# EAGLE design air (EAGLE 9.1.3)
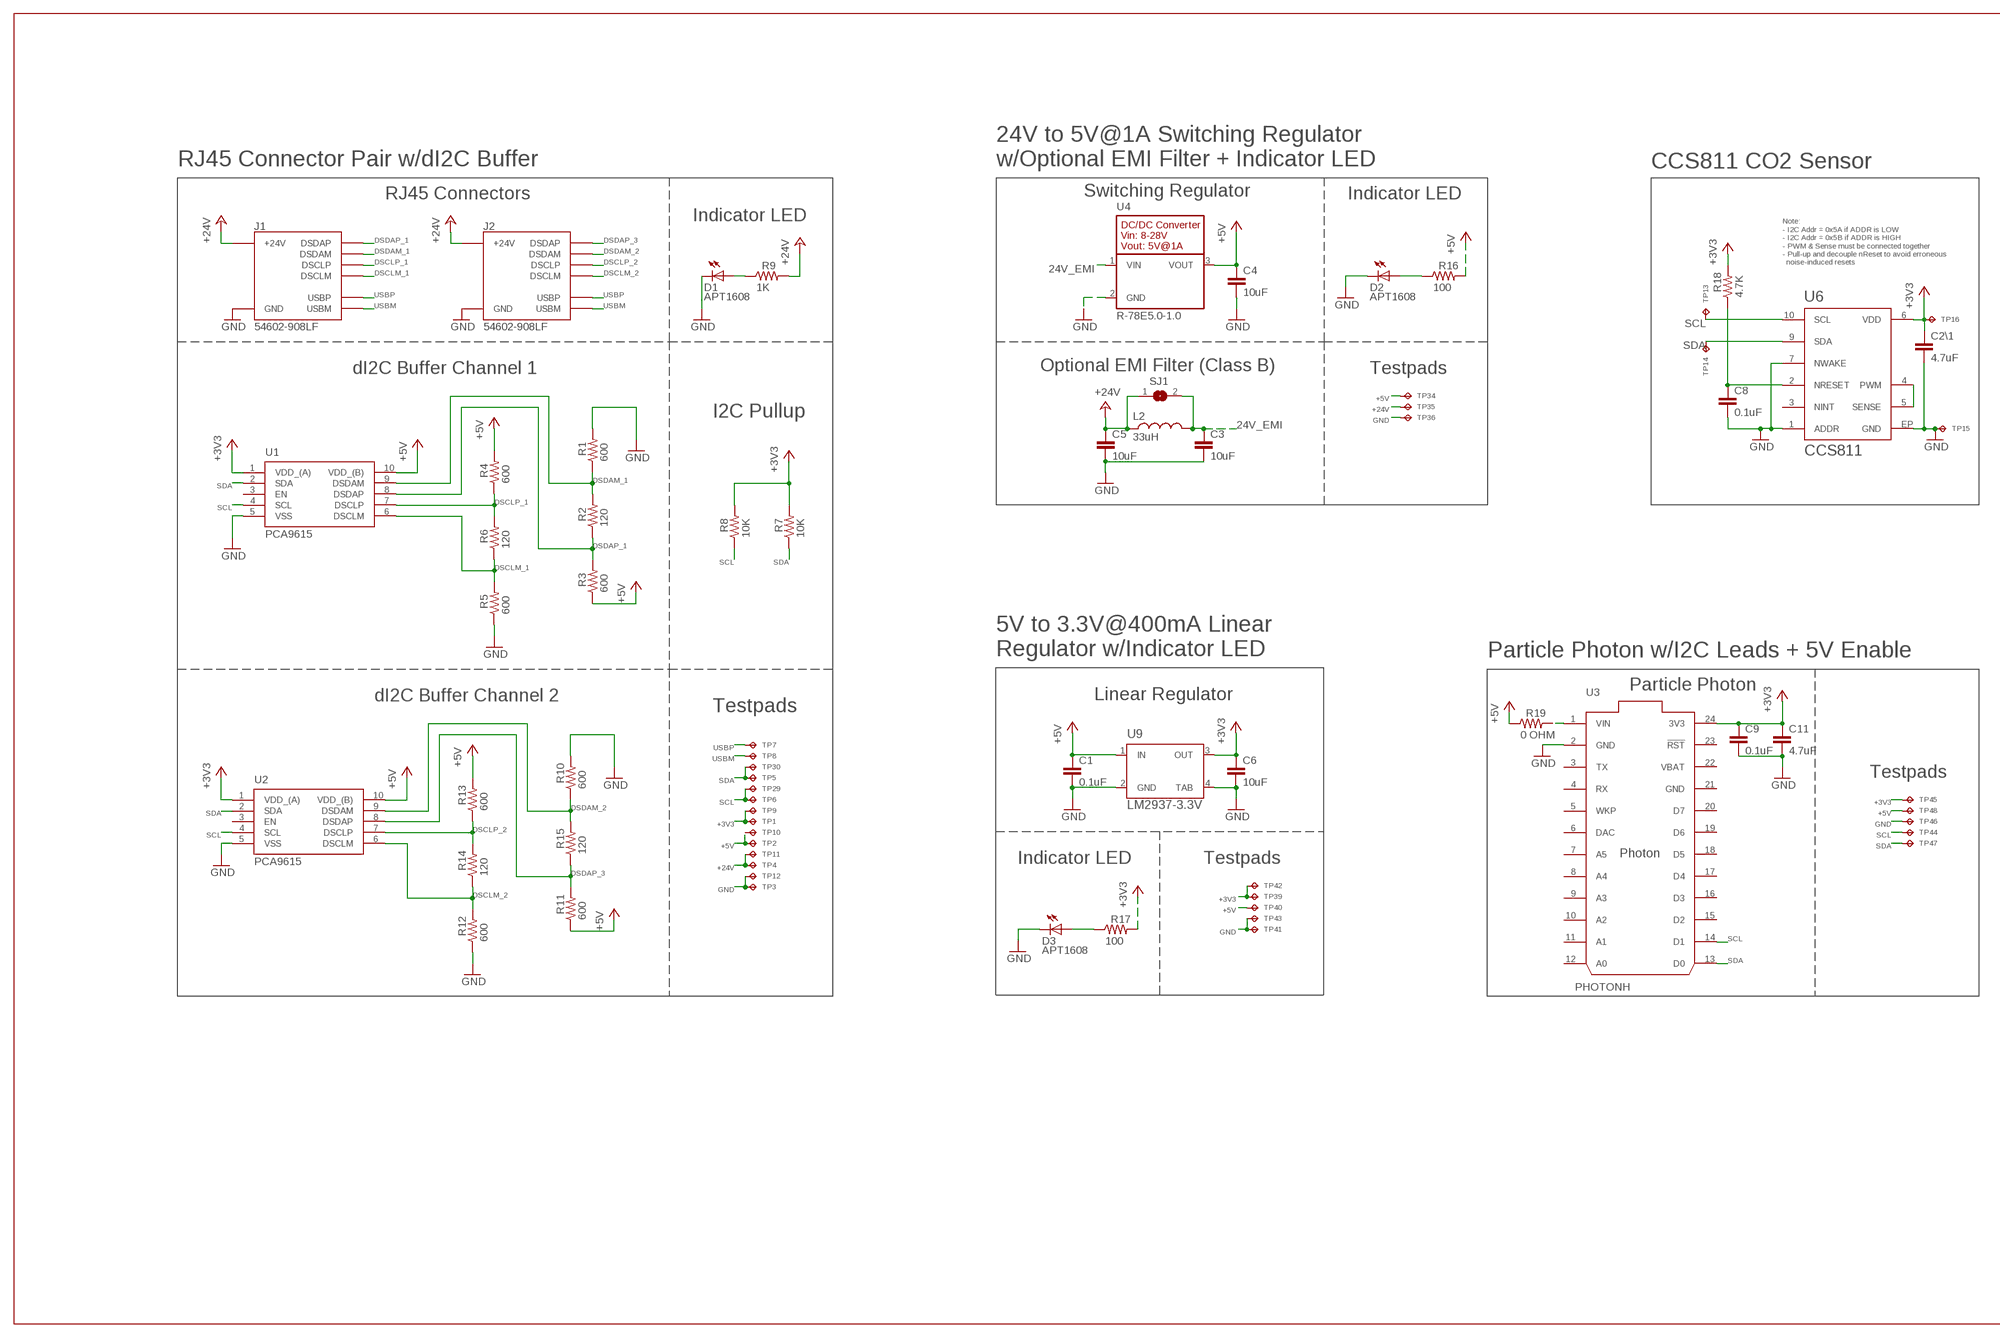
[diagram p0: schematic, sheet 1, part 1 of 2]
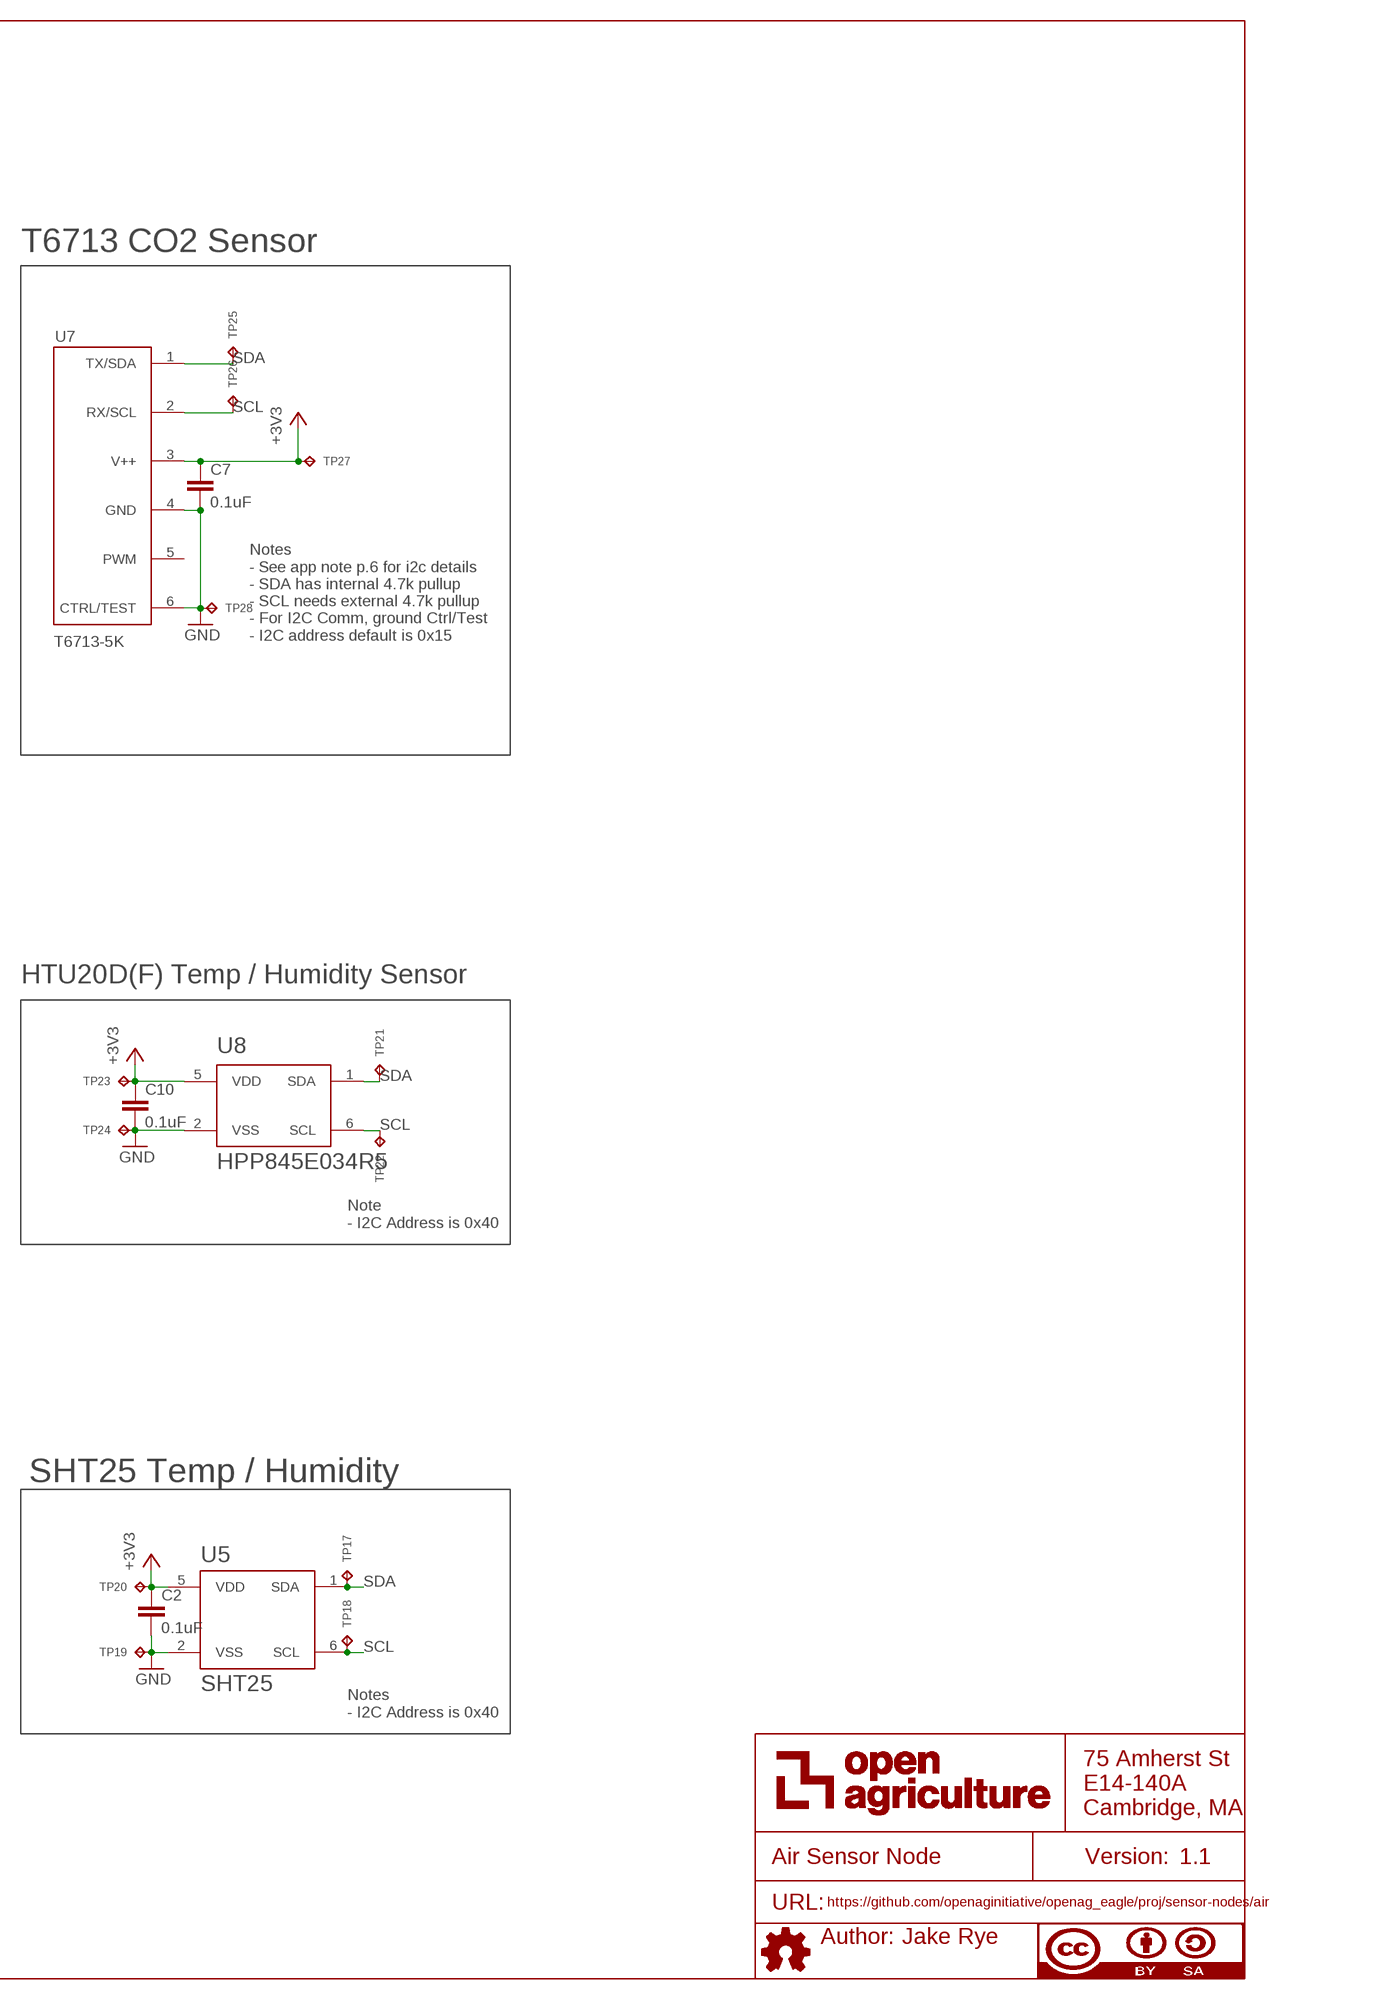
[diagram p1: schematic, sheet 1, part 2 of 2]

## Parts
C1  0.1uF  0.1UF-C0603C104K5RACTU  [C0603]
C2  0.1uF  0.1UF-C0603C104K5RACTU  [C0603]
C2\1  4.7uF  4.7UF-CL21A475KBQNNNE  [C0805]
C3  10uF  10UF-GMK212BBJ106KG-T  [C0805]
C4  10uF  10UF-GMK212BBJ106KG-T  [C0805]
C5  10uF  10UF-GMK212BBJ106KG-T  [C0805]
C6  10uF  10UF-GMK212BBJ106KG-T  [C0805]
C7  0.1uF  0.1UF-C0603C104K5RACTU  [C0603]
C8  0.1uF  0.1UF-C0603C104K5RACTU  [C0603]
C9  0.1uF  0.1UF-C0603C104K5RACTU  [C0603]
C10  0.1uF  0.1UF-C0603C104K5RACTU  [C0603]
C11  4.7uF  4.7UF-CL21A475KBQNNNE  [C0805]
D1  APT1608  APT1608CGCK  [CHIPLED_0603]
D2  APT1608  APT1608CGCK  [CHIPLED_0603]
D3  APT1608  APT1608CGCK  [CHIPLED_0603]
J1  54602-908LF  RJ45-DI2C-USB-54602-908LFPTH  [RJ45-DI2C-USB-54602-908LF]
J2  54602-908LF  RJ45-DI2C-USB-54602-908LFPTH  [RJ45-DI2C-USB-54602-908LF]
L2  33uH  33UH-29333C  [29333C]
R1  600  600OHM-RC0603FR-07604RL  [RC0603N]
R2  120  120OHM-RC0603FR-07120RL  [RC0603N]
R3  600  600OHM-RC0603FR-07604RL  [RC0603N]
R4  600  600OHM-RC0603FR-07604RL  [RC0603N]
R5  600  600OHM-RC0603FR-07604RL  [RC0603N]
R6  120  120OHM-RC0603FR-07120RL  [RC0603N]
R7  10K  10K-ERJ-3EKF1002V  [RC0603N]
R8  10K  10K-ERJ-3EKF1002V  [RC0603N]
R9  1K  1K-ERJ-PB3D1001V  [RC0603N]
R10  600  600OHM-RC0603FR-07604RL  [RC0603N]
R11  600  600OHM-RC0603FR-07604RL  [RC0603N]
R12  600  600OHM-RC0603FR-07604RL  [RC0603N]
R13  600  600OHM-RC0603FR-07604RL  [RC0603N]
R14  120  120OHM-RC0603FR-07120RL  [RC0603N]
R15  120  120OHM-RC0603FR-07120RL  [RC0603N]
R16  100  100OHM-RC0603JR-07100RL  [RC0603N]
R17  100  100OHM-RC0603JR-07100RL  [RC0603N]
R18  4.7K  4.7K-RC1206JR-074K7L  [R1206]
R19  0 OHM  0OHM-RC0603JR-070RL  [RC0603N]
SJ1  EMI-BYPASS  [EMI-BYPASS]
TP1  TPTP04R  [TP04R]
TP2  TPTP04R  [TP04R]
TP3  TPTP04R  [TP04R]
TP4  TPTP04R  [TP04R]
TP5  TPTP04R  [TP04R]
TP6  TPTP04R  [TP04R]
TP7  TPTP04R  [TP04R]
TP8  TPTP04R  [TP04R]
TP9  TPTP04R  [TP04R]
TP10  TPTP04R  [TP04R]
TP11  TPTP04R  [TP04R]
TP12  TPTP04R  [TP04R]
TP13  TPTP06R  [TP06R]
TP14  TPTP06R  [TP06R]
TP15  TPTP06R  [TP06R]
TP16  TPTP06R  [TP06R]
TP17  TPTP06R  [TP06R]
TP18  TPTP06R  [TP06R]
TP19  TPTP06R  [TP06R]
TP20  TPTP06R  [TP06R]
TP21  TPTP06R  [TP06R]
TP22  TPTP06R  [TP06R]
TP23  TPTP06R  [TP06R]
TP24  TPTP06R  [TP06R]
TP25  TPTP06R  [TP06R]
TP26  TPTP06R  [TP06R]
TP27  TPTP06R  [TP06R]
TP28  TPTP06R  [TP06R]
TP29  TPTP04R  [TP04R]
TP30  TPTP04R  [TP04R]
TP34  TPTP06R  [TP06R]
TP35  TPTP06R  [TP06R]
TP36  TPTP06R  [TP06R]
TP39  TPTP04R  [TP04R]
TP40  TPTP04R  [TP04R]
TP41  TPTP04R  [TP04R]
TP42  TPTP04R  [TP04R]
TP43  TPTP04R  [TP04R]
TP44  TPTP04R  [TP04R]
TP45  TPTP04R  [TP04R]
TP46  TPTP04R  [TP04R]
TP47  TPTP04R  [TP04R]
TP48  TPTP04R  [TP04R]
U1  PCA9615  PCA9615DPJ  [SOP50P490X110-10N]
U2  PCA9615  PCA9615DPJ  [SOP50P490X110-10N]
U3  PHOTONH  PHOTONH-LABELS  [PHOTON]
U4  R-78E5.0-1.0  [R-78E5.0-1.0]
U5  SHT25  [SHT2X]
U6  CCS811  [CCS811]
U7  T6713-5K  [T6713]
U8  HPP845E034R5  [HTU20D(F)]
U9  LM2937-3.3V  LM2937IMP-3.3/NOPB  [MP04A]
U$1  AUTHOR  [AUTHOR]
U$2  TITLE  [TITLE]

## Nets
24V_EMI: C3.1 L2.2 SJ1.2 U4.1(VIN)
+3V3: C2.1 C2\1.1 C6.1 C7.1 C9.1 C10.1 C11.1 R7.2 R8.2 R17.2 R18.2 TP1.1(TP) TP9.1(TP) TP16.TP TP20.TP TP23.TP TP27.TP TP39.1(TP) TP42.1(TP) TP45.1(TP) U1.1(VDD_(A)) U2.1(VDD_(A)) U3.24(3V3) U5.5(VDD) U6.6(VDD) U7.3(V++) U8.5(VDD) U9.3(OUT)
+5V: C1.1 C4.1 R3.1 R4.2 R11.1 R13.2 R16.2 R19.1 TP2.1(TP) TP10.1(TP) TP34.TP TP40.1(TP) TP48.1(TP) U1.10(VDD_(B)) U2.10(VDD_(B)) U4.3(VOUT) U9.1(IN)
+24V: C5.1 J1.24V(6)(+24V) J2.24V(6)(+24V) L2.1 R9.2 SJ1.1 TP4.1(TP) TP11.1(TP) TP35.TP
DSCLM_1: J1.DSCLM(5)(DSCLM) R5.2 R6.1 U1.6(DSCLM)
DSCLM_2: J2.DSCLM(5)(DSCLM) R12.2 R14.1 U2.6(DSCLM)
DSCLP_1: J1.DSCLP(4)(DSCLP) R4.1 R6.2 U1.7(DSCLP)
DSCLP_2: J2.DSCLP(4)(DSCLP) R13.1 R14.2 U2.7(DSCLP)
DSDAM_1: J1.DSDAM(2)(DSDAM) R1.1 R2.2 U1.9(DSDAM)
DSDAM_2: J2.DSDAM(2)(DSDAM) R10.1 R15.2 U2.9(DSDAM)
DSDAP_1: J1.DSDAP(1)(DSDAP) R2.1 R3.2 U1.8(DSDAP)
DSDAP_3: J2.DSDAP(1)(DSDAP) R11.2 R15.1 U2.8(DSDAP)
GND: C1.2 C2.2 C2\1.2 C3.2 C4.2 C5.2 C6.2 C7.2 C8.2 C9.2 C10.2 C11.2 D1.C D2.C D3.C J1.GND(3)(GND) J2.GND(3)(GND) R1.2 R5.1 R10.2 R12.1 TP3.1(TP) TP12.1(TP) TP15.TP TP19.TP TP24.TP TP28.TP TP36.TP TP41.1(TP) TP43.1(TP) TP46.1(TP) U1.5(VSS) U2.5(VSS) U3.2(GND) U4.2(GND) U5.2(VSS) U6.1(ADDR) U6.7(NWAKE) U6.EP(GND) U7.4(GND) U7.6(CTRL/TEST) U8.2(VSS) U9.2(GND) U9.4(TAB)
N$4: D2.A R16.1
N$5: D3.A R17.1
N$6: D1.A R9.1
N$8: R19.2 U3.1(VIN)
N$20: U6.4(PWM) U6.5(SENSE)
N$21: C8.1 R18.1 U6.2(NRESET)
SCL: R8.1 TP6.1(TP) TP13.TP TP18.TP TP22.TP TP26.TP TP29.1(TP) TP44.1(TP) U1.4(SCL) U2.4(SCL) U3.14(D1) U5.6(SCL) U6.10(SCL) U7.2(RX/SCL) U8.6(SCL)
SDA: R7.1 TP5.1(TP) TP14.TP TP17.TP TP21.TP TP25.TP TP30.1(TP) TP47.1(TP) U1.2(SDA) U2.2(SDA) U3.13(D0) U5.1(SDA) U6.9(SDA) U7.1(TX/SDA) U8.1(SDA)
USBM: J1.USBM(8)(USBM) J2.USBM(8)(USBM) TP8.1(TP)
USBP: J1.USBP(7)(USBP) J2.USBP(7)(USBP) TP7.1(TP)
Unconnected: U1.3(EN) U2.3(EN) U3.3(TX) U3.4(RX) U3.5(WKP) U3.6(DAC) U3.7(A5) U3.8(A4) U3.9(A3) U3.10(A2) U3.11(A1) U3.12(A0) U3.15(D2) U3.16(D3) U3.17(D4) U3.18(D5) U3.19(D6) U3.20(D7) U3.23(!RST) U6.3(NINT) U7.5(PWM)

## Notes on the sheet
- RJ45 Connector Pair w/dI2C Buffer
- 24V to 5V@1A Switching Regulator
  w/Optional EMI Filter + Indicator LED
- CCS811 CO2 Sensor | T6713 CO2 Sensor
- RJ45 Connectors | Switching Regulator | Indicator LED
- Indicator LED
- Note:
  - I2C Addr = 0x5A if ADDR is LOW
  - I2C Addr = 0x5B if ADDR is HIGH
  - PWM & Sense must be connected together
  - Pull-up and decouple nReset to avoid erroneous
    noise-induced resets
- dI2C Buffer Channel 1 | Optional EMI Filter (Class B) | Testpads
- I2C Pullup
- Notes
  - See app note p.6 for i2c details
  - SDA has internal 4.7k pullup
  - SCL needs external 4.7k pullup
  - For I2C Comm, ground Ctrl/Test
  - I2C address default is 0x15
- 5V to 3.3V@400mA Linear 
  Regulator w/Indicator LED
- Particle Photon w/I2C Leads + 5V Enable | HTU20D(F) Temp / Humidity Sensor
- Particle Photon
- dI2C Buffer Channel 2 | Linear Regulator
- Testpads
- Testpads
- Note
  - I2C Address is 0x40
- Indicator LED | Testpads
- SHT25 Temp / Humidity
- Notes
  - I2C Address is 0x40

## Power pins joined to a net without a drawn wire
GND: U3.21(GND)
VBAT: U3.22(VBAT)

## Library data of the parts
C1 C2 C7-C10 = openag-capacitors:0.1UF-C0603C104K5RACTU: CAP CER 0.1UF 50V X7R 0603 Description: 0.1µF ±10% 50V Ceramic Capacitor X7R 0603 (1608 Metric) Technical Specifications: Capacitance: 0.1µF Tolerance: ±10% Rated Voltage: 50V Temperature Coefficient: X7R Operating Temperature: -55°C ~ 125°C Package / Case: 0603 (1608 Metric) Datasheet(s): X7R Dielectric, 6.3-250 VDC <https://search.kemet.com/component-edge/download/datasheet/C0603C104K5RACTU.pdf> Vendor(s): Digikey: 399-5089-1-ND <https://www.digikey.com/product-detail/en/kemet/C0603C104K5RACTU/399-5089-1-ND/1465623>; MANUFACTURER: Kemet; MPN: C0603C104K5RACTU; VENDOR: Digikey; VLINK: https://www.digikey.com/product-detail/en/kemet/C0603C104K5RACTU/399-5089-1-ND/1465623; VPN: 399-5089-1-ND
C2\1 C11 = openag-capacitors:4.7UF-CL21A475KBQNNNE: CAP CER 4.7UF 50V X5R 0805 Description: 4.7µF ±10% 50V Ceramic Capacitor X5R 0805 (2012 Metric) Technical Specifications: Capacitance: 4.7uF Tolerance: ±10% Rated Voltage: 50V Temperature Coefficient: X5R Operating Temperature: -55°C ~ 85°C Package/Case: 0805 (2012 Metric) Datasheet(s): CL21A475KBQNNNE Characteristics <http://www.samsungsem.com/kr/front/downloadcms.do?path=/kr/support/product-search/mlcc/__icsFiles/afieldfile/2014/11/05&fileName=C_CL21A475KBQNNNE.pdf> Vendor(s): Digikey: 1276-1248-1-ND <https://www.digikey.com/product-detail/en/samsung-electro-mechanics/CL21A475KBQNNNE/1276-1248-1-ND/3889334>; MANUFACTURER: Samsung; MPN: CL21A475KBQNNNE; VENDOR: Digikey; VLINK: https://www.digikey.com/product-detail/en/samsung-electro-mechanics/CL21A475KBQNNNE/1276-1248-1-ND/3889334; VPN: 1276-1248-1-ND
C3-C6 = openag-capacitors:10UF-GMK212BBJ106KG-T: CAP CER 10UF 35V X5R 0805 Description: 10µF ±10% 35V Ceramic Capacitor X5R 0805 (2012 Metric) Technical Specifications: Capacitance: 10µF Tolerance: ±10% Rated Voltage: 35V Temperature Coefficient: X5R Operating Temperature: -55°C ~ 85°C Package / Case: 0805 (2012 Metric) Datasheet(s): GMK212BBJ106KG-T Spec <http://ds.yuden.co.jp/TYCOMPAS/ut/detail.do?productNo=GMK212BBJ106KG-T&fileName=GMK212BBJ106KG-T_SS&mode=specSheetDownload> Vendor(s): Digikey: 587-4893-1-ND <https://www.digikey.com/product-detail/en/taiyo-yuden/GMK212BBJ106KG-T/587-4893-1-ND/6563736>; MANUFACTURER: Taiyo Yuden; MPN: GMK212BBJ106KG-T; VENDOR: Digikey; VLINK: https://www.digikey.com/product-detail/en/taiyo-yuden/GMK212BBJ106KG-T/587-4893-1-ND/6563736; VPN: 587-4893-1-ND
D1-D3 = openag-diodes:APT1608CGCK: LED GREEN CLEAR 0603 SMD Description: Green 570nm LED Indication - Discrete 2.1V 0603 (1608 Metric) Technical Specifications: Color: Green Lens Color: Colorless Lens Transparency: Clear Millicandela Rating: 50mcd Lens Style/Size: Rectangle with Flat Top, 1.20mm x 0.80mm Voltage - Forward (Vf) (Typ): 2.1V Current - Test: 20mA Viewing Angle: 120° Mounting Type: Surface Mount Wavelength - Dominant: 570nm Wavelength - Peak: 574nm Package / Case: 0603 (1608 Metric) Supplier Device Package: Chip LED Size / Dimension: 1.60mm L x 0.80mm W Height (Max): 0.75mm Datasheet(s): APT1608CGCK <http://www.kingbrightusa.com/images/catalog/SPEC/APT1608CGCK.pdf> Vendor(s): Digikey: 754-1116-1-ND <https://www.digikey.com/product-detail/en/kingbright/APT1608CGCK/754-1116-1-ND/1747833#>; MANUFACTURER: Kingbright; MPN: APT1608CGCK; VENDOR: Digikey; VLINK: https://www.digikey.com/product-detail/en/kingbright/APT1608CGCK/754-1116-1-ND/1747833#; VPN: 754-1116-1-ND
J1 J2 = openag-connectors:RJ45-DI2C-USB-54602-908LF: CONN MOD JACK 8P8C R/A UNSHLD Description: Jack Modular Connector 8p8c (RJ45, Ethernet) 90° Angle (Right) Unshielded Cat3 Technical Specifications: Connector Type: Jack Number of Positions/Contacts: 8p8c (RJ45, Ethernet) Number of Ports: 1 Number of Rows: 1 Mounting Type: Through Hole Orientation: 90° Angle (Right) Termination: Solder Shielding: Unshielded Ratings: Cat3 Features: Board Lock LED Color: Does Not Contain LED Tab Direction: Down Contact Material: Copper Alloy Contact Finish: Gold Contact Finish Thickness: 15µin (0.38µm) Housing Material: Polyester, Glass Filled Operating Temperature: -40°C ~ 70°C Datasheet(s): 54601-x04(zzz)WPLF Drawing <http://cdn.amphenol-icc.com/media/wysiwyg/files/drawing/c-bmj-0102.pdf> Vendor(s): Digikey: 609-1046-ND <https://www.digikey.com/product-detail/en/amphenol-fci/54602-908LF/609-1046-ND/1001360>; MANUFACTURER: Amphenol FCI; MPN: 54602-908LF; VENDOR: Digikey; VLINK: https://www.digikey.com/product-detail/en/amphenol-fci/54602-908LF/609-1046-ND/1001360; VPN: 609-1046-ND
L2 = openag-inductors:33UH-29333C: FIXED IND 33UH 1A 120 MOHM SMD Description: 33µH Shielded Wirewound Inductor 1A 120 mOhm Max Nonstandard Technical Specifications: Type: Wirewound Inductance: 33µH Current Rating: 1A Shielding: Shielded DC Resistance (DCR): 120 mOhm Max Operating Temperature: -40°C ~ 85°C Frequency - Test: 10kHz Mounting Type: Surface Mount Package / Case: Nonstandard Size / Dimension: 0.283" L x 0.283" W (7.20mm x 7.20mm) Height - Seated (Max): 0.157" (4.00mm) Datasheet(s): 2900 Series <https://www.murata-ps.com/data/magnetics/kmp_2900.pdf> Vendor(s): Digikey: 811-1138-1-ND <https://www.digikey.com/product-detail/en/murata-power-solutions-inc/29333C/811-1138-1-ND/1924860>; MANUFACTURER: Murata Power Solutions Inc.; MPN: 29333C; VENDOR: Digikey; VLINK: https://www.digikey.com/product-detail/en/murata-power-solutions-inc/29333C/811-1138-1-ND/1924860; VPN: 811-1138-1-ND
R1 R3-R5 R10-R13 = openag-resistors:600OHM-RC0603FR-07604RL: RES SMD 604 OHM 1% 1/10W 0603 Description: 604 Ohms ±1% 0.1W, 1/10W Chip Resistor 0603 (1608 Metric) Moisture Resistant Thick Film Technical Specifications: Resistance: 604 Ohms Tolerance: ±1% Power (Watts): 0.1W, 1/10W Composition: Thick Film Features: Moisture Resistant Temperature Coefficient: ±100ppm/°C Operating Temperature: -55°C ~ 155°C Package / Case: 0603 (1608 Metric) Supplier Device Package: 0603 Size / Dimension: 0.063" L x 0.032" W (1.60mm x 0.80mm) Height - Seated (Max): 0.022" (0.55mm) Number of Terminations: 2 Datasheet(s): RC Series, L Datasheet <http://www.yageo.com/documents/recent/PYu-RC_Group_51_RoHS_L_8.pdf> Chip Resistor Marking <http://www.yageo.com/exep/pages/download/literatures/PYu-R_Marking_2.pdf> Vendor(s): Digikey: 311-604HRCT-ND <https://www.digikey.com/product-detail/en/yageo/RC0603FR-07604RL/311-604HRCT-ND/730276>; MANUFACTURER: Yageo; MPN: RC0603FR-07604RL; VENDOR: Digikey; VLINK: https://www.digikey.com/product-detail/en/yageo/RC0603FR-07604RL/311-604HRCT-ND/730276; VPN: 311-604HRCT-ND
R2 R6 R14 R15 = openag-resistors:120OHM-RC0603FR-07120RL: RES SMD 120 OHM 1% 1/10W 0603 Description: 120 Ohms ±1% 0.1W, 1/10W Chip Resistor 0603 (1608 Metric) Moisture Resistant Thick Film Technical Specifications: Resistance: 120 Ohms Tolerance: ±1% Power (Watts): 0.1W, 1/10W Composition: Thick Film Features: Moisture Resistant Temperature Coefficient: ±100ppm/°C Operating Temperature: -55°C ~ 155°C Package / Case: 0603 (1608 Metric) Supplier Device Package: 0603 Size / Dimension: 0.063" L x 0.032" W (1.60mm x 0.80mm) Height - Seated (Max): 0.022" (0.55mm) Number of Terminations: 2 Datasheet(s): RC Series, L Datasheet <http://www.yageo.com/documents/recent/PYu-RC_Group_51_RoHS_L_8.pdf> Chip Resistor Marking <http://www.yageo.com/exep/pages/download/literatures/PYu-R_Marking_2.pdf> Vendor(s): Digikey: 311-120HRCT-ND <https://www.digikey.com/product-detail/en/yageo/RC0603FR-07120RL/311-120HRCT-ND/729867>; MANUFACTURER: Yageo; MPN: RC0603FR-07120RL; VENDOR: Digikey; VLINK: https://www.digikey.com/product-detail/en/yageo/RC0603FR-07120RL/311-120HRCT-ND/729867; VPN: 311-120HRCT-ND
R7 R8 = openag-resistors:10K-ERJ-3EKF1002V: RES SMD 10K OHM 1% 1/10W 0603 Description: 10 kOhms ±1% 0.1W, 1/10W Chip Resistor 0603 (1608 Metric) Automotive AEC-Q200 Thick Film Technical Specifications: Resistance: 10kOhms Tolerance: ±1% Power: 0.1W, 1/10W Operating Temperature: -55°C ~ 155°C Package/Case: 0603 (1608 Metric) Datasheet(s): ERJ-3EKF1002V View All Specifications <https://industrial.panasonic.com/ww/products/resistors/chip-resistors/general-purpose-chip-resistors/precision-thick-film-chip-resistors/ERJ3EKF1002V> Vendor(s): Digikey: P10.0KHCT-ND <https://www.digikey.com/product-detail/en/panasonic-electronic-components/ERJ-3EKF1002V/P10.0KHCT-ND/198102>; MANUFACTURER: Panasonic; MPN: ERJ-3EKF1002V; VENDOR: Digikey; VLINK: https://www.digikey.com/product-detail/en/panasonic-electronic-components/ERJ-3EKF1002V/P10.0KHCT-ND/198102; VPN: P10.0KHCT-ND
R9 = openag-resistors:1K-ERJ-PB3D1001V: RES SMD 1K OHM 0.5% 1/5W 0603 Description: 1 kOhms ±0.5% 0.2W, 1/5W Chip Resistor 0603 (1608 Metric) Automotive AEC-Q200, Pulse Withstanding Thick Film Technical Specifications: Resistance: 1 kOhms Tolerance: ±0.5% Power: 0.2W, 1/5W Operating Temperature: -55°C ~ 155°C Package / Case: 0603 (1608 Metric) Datasheet(s): ERJ-PB3, PB6 Series, High Precision Datasheet <https://industrial.panasonic.com/cdbs/www-data/pdf/RDM0000/AOA0000C328.pdf> Vendor(s): Digikey: P20283CT-ND <https://www.digikey.com/product-detail/en/panasonic-electronic-components/ERJ-PB3D1001V/P20283CT-ND/6214538>; MANUFACTURER: Panasonic; MPN: P20283CT-ND; VENDOR: Digikey; VLINK: https://www.digikey.com/product-detail/en/panasonic-electronic-components/ERJ-PB3D1001V/P20283CT-ND/6214538; VPN: P20283CT-ND
R16 R17 = openag-resistors:100OHM-RC0603JR-07100RL: RES SMD 100 OHM 5% 1/10W 0603 Description: 100 Ohms ±5% 0.1W, 1/10W Chip Resistor 0603 (1608 Metric) Moisture Resistant Thick Film Technical Specifications: Resistance: 100 Ohms Tolerance: ±5% Power (Watts): 0.1W, 1/10W Composition: Thick Film Features: Moisture Resistant Temperature Coefficient: ±100ppm/°C Operating Temperature: -55°C ~ 155°C Package / Case: 0603 (1608 Metric) Supplier Device Package: 0603 Size / Dimension: 0.063" L x 0.032" W (1.60mm x 0.80mm) Height - Seated (Max): 0.022" (0.55mm) Number of Terminations: 2 Datasheet(s): Thick Film Chip Resistor Intro <http://www.yageo.com.tw/exep/pages/download/literatures/PYu-R_INT-thick_7.pdf> Chip Resistor Marking <http://www.yageo.com/exep/pages/download/literatures/PYu-R_Marking_2.pdf> RC Series, L Datasheet <http://www.yageo.com/documents/recent/PYu-RC_Group_51_RoHS_L_8.pdf> Vendor(s): Digikey: 311-100GRCT-ND <https://www.digikey.com/product-detail/en/yageo/RC0603JR-07100RL/311-100GRCT-ND/729644>; MANUFACTURER: Yageo; MPN: RC0603JR-07100RL; VENDOR: Digikey; VLINK: https://www.digikey.com/product-detail/en/yageo/RC0603JR-07100RL/311-100GRCT-ND/729644; VPN: 311-100GRCT-ND
R18 = openag-resistors:4.7K-RC1206JR-074K7L: RES SMD 4.7K OHM 5% 1/4W 1206 Description: 4.7 kOhms ±5% 0.25W, 1/4W Chip Resistor 1206 (3216 Metric) Moisture Resistant Thick Film Technical Specifications: Resistance: 4.7 kOhms Tolerance: ±5% Power (Watts): 0.25W, 1/4W Composition: Thick Film Features: Moisture Resistant Temperature Coefficient: ±100ppm/°C Operating Temperature: -55°C ~ 155°C Package / Case: 1206 (3216 Metric) Supplier Device Package: 1206 Size / Dimension: 0.122" L x 0.063" W (3.10mm x 1.60mm) Height - Seated (Max): 0.026" (0.65mm) Number of Terminations: 2 Datasheet(s): Thick Film Chip Resistor Intro <http://www.yageo.com.tw/exep/pages/download/literatures/PYu-R_INT-thick_7.pdf> Chip Resistor Marking <http://www.yageo.com/exep/pages/download/literatures/PYu-R_Marking_2.pdf> RC Series, L Datasheet <http://www.yageo.com/documents/recent/PYu-RC_Group_51_RoHS_L_8.pdf> Vendor(s): Digikey: 311-4.7KERCT-ND <https://www.digikey.com/product-detail/en/yageo/RC1206JR-074K7L/311-4.7KERCT-ND/732242>; MANUFACTURER: Yageo; MPN: RC1206JR-074K7L; VENDOR: Digikey; VLINK: https://www.digikey.com/product-detail/en/yageo/RC1206JR-074K7L/311-4.7KERCT-ND/732242; VPN: 311-4.7KERCT-ND
R19 = openag-resistors:0OHM-RC0603JR-070RL: RES SMD 0 OHM JUMPER 1/10W 0603 Description: 0 Ohms Jumper 0.1W, 1/10W Chip Resistor 0603 (1608 Metric) Moisture Resistant Thick Film Technical Specifications: Resistance: 0 Ohms Power: 0.1W, 1/10W Operating Temperature: -55°C ~ 155°C Package / Case: 0603 (1608 Metric) Datasheet(s): RC Series, L Datasheet <http://www.yageo.com/documents/recent/PYu-RC_Group_51_RoHS_L_8.pdf> Vendor(s): Digikey: 311-0.0GRCT-ND <https://www.digikey.com/product-detail/en/yageo/RC0603JR-070RL/311-0.0GRCT-ND/729622>; MANUFACTURER: Yageo; MPN: RC0603JR-070RL; VENDOR: Digikey; VLINK: https://www.digikey.com/product-detail/en/yageo/RC0603JR-070RL/311-0.0GRCT-ND/729622; VPN: 311-0.0GRCT-ND
SJ1 = openag-connectors:EMI-BYPASS: EMI Bypass Solder Jumper; MPN: N/A
TP1-TP30 TP34-TP36 TP39-TP48 = openag-testpads:TP: Test pad; MPN: N/A
U1 U2 = openag-redrivers:PCA9615DPJ: IC REDRIVER I2C 2CH 10TSSOP Description: Buffer, ReDriver 2 Channel 400kHz 10-TSSOP Technical Specifications: Type: Buffer, ReDriver Applications: I²C Input: 2-Wire Bus Output: 2-Wire Bus Data Rate (Max): 400kHz Number of Channels: 2 Capacitance - Input: 7pF Voltage - Supply: 2.3 V ~ 5.5 V Current - Supply: 16µA Operating Temperature: -40°C ~ 85°C Package / Case: 10-TFSOP, 10-MSOP (0.118", 3.00mm Width) Supplier Device Package: 10-TSSOP Base Part Number: PCA9615 Datasheet(s): PCA9615DP <http://www.nxp.com/documents/data_sheet/PCA9615.pdf> Vendor(s): Digikey: 568-11484-1-ND <https://www.digikey.com/product-detail/en/nxp-usa-inc/PCA9615DPJ/568-11484-1-ND/4864508>; MANUFACTURER: NXP USA Inc.; MPN: PCA9615DPJ; VENDOR: Digikey; VLINK: https://www.digikey.com/product-detail/en/nxp-usa-inc/PCA9615DPJ/568-11484-1-ND/4864508; VPN: 568-11484-1-ND
U3 = openag-microcontrollers:PHOTONH: Tiny Wi-Fi dev board w/cloud backend Description: The Photon is a $19 tiny Wi-Fi development kit for creating connected projects and products for the Internet of Things. It's easy to use, it's powerful, and it's connected to the cloud. Technical Specifications: Processor: STM32F205RGY6 120Mhz ARM Cortex M3 Wireless: 802.11b/g/n Wi-Fi Peripherals: Digital(x18), ADC(x8), DAC(x2), SPI(x2), I2S(x1), I2C(x1) SPI, CAN(1), USB(1), PWM(9) Memory: 1MB flash, 128KB RAM Cerfifications: FCC, CE and IC Operating Temperature: -20°C ~ 60°C Humidity Range: Non condensing, relative humidity: 95% Supply Input Voltage (VIN): 3.6V ~ 5.5V Supply Input Voltage (3V3): 3.0V ~ 3.6V Max Supply Output Current (VIN): 1A Max Supply Output Current (3V3): 100mA Average Operating Current (WiFi on, @VIN): up to 100mA Peak Operating Current (WiFi on, @VIN): up to 430mA I/O Max Source/Sink Current (Individual): 25mA I/O Max Source/Sinnk Current (Total): 120mA Datasheet(s): Photon Datasheet <https://docs.particle.io/datasheets/photon-datasheet/> Vendor(s): Particle: PHOTONH <https://store.particle.io/products/photon>; MANUFACTURER: Particle; MPN: PHOTONH; VENDOR: Particle; VLINK: https://store.particle.io/products/photon; VPN: PHOTONH
U4 = openag-regulators:R-78E5.0-1.0: DC/DC CONVERTER 5V 5W Description: Linear Regulator Replacement DC DC Converter 1 Output 5V 1A 8V - 28V Input Technical Specifications: Type: Linear Regulator Replacement Number of Outputs: 1 Voltage - Input (Min): 8V Voltage - Input (Max): 28V Voltage - Output 1: 5V Current - Output (Max): 1A Power (Watts): 5W Applications: ITE (Commercial) Features: SCP Operating Temperature: -40°C ~ 85°C Efficiency: 91% Mounting Type: Through Hole Package / Case: 3-SIP Module Size / Dimension: 0.46" L x 0.33" W x 0.41" H (11.6mm x 8.5mm x 10.4mm) Datasheet(s): R-78E-1.0 Series Datasheet <https://www.recom-power.com/pdf/Innoline/R-78Exx-1.0.pdf> Vendor(s): Digikey: 945-2201-ND <https://www.digikey.com/product-detail/en/recom-power/R-78E5.0-1.0/945-2201-ND/4930585>; MANUFACTURER: Recom Power; MPN: R-78E5.0-1.0; VENDOR: Digikey; VLINK: https://www.digikey.com/product-detail/en/recom-power/R-78E5.0-1.0/945-2201-ND/4930585; VPN: 945-2201-ND
U5 = openag-sensors:SHT25: SENSOR HUMI/TEMP 3V I2C 1.8% SMD Description: Humidity Temperature Sensor 0 ~ 100% RH I²C ±1.8% RH 8s Surface Mount Technical Specifications: Sensor Type: Humidity, Temperature Humidity Range: 0 ~ 100% RH Output Type: I²C Output: 12b Accuracy: ±1.8% RH Response Time: 8s Voltage - Supply: 2.1 V ~ 3.6 V Mounting Type: Surface Mount Operating Temperature: -40°C ~ 125°C Datasheet(s): SHTxx Testing Guide <https://www.sensirion.com/fileadmin/user_upload/customers/sensirion/Dokumente/2_Humidity_Sensors/Sensirion_Humidity_Sensors_Testing_Guide_V1.2.pdf> SHTxx Handling Instructions <https://www.sensirion.com/fileadmin/user_upload/customers/sensirion/Dokumente/2_Humidity_Sensors/Sensirion_Humidity_Sensors_Handling_Instructions_V4.pdf> Sensor Specification Statement <https://www.sensirion.com/fileadmin/user_upload/customers/sensirion/Dokumente/2_Humidity_Sensors/Sensirion_Humidity_Sensors_Specification_Statement_V1.pdf> SHTxx, STSxx Assembly SMD Pkgs <https://www.sensirion.com/fileadmin/user_upload/customers/sensirion/Dokumente/2_Humidity_Sensors/Sensirion_Humidity_Sensors_Handling_of_SMD_Packages_V1.pdf> SHT25 Datasheet <https://www.sensirion.com/fileadmin/user_upload/customers/sensirion/Dokumente/2_Humidity_Sensors/Sensirion_Humidity_Sensors_SHT25_Datasheet_V3.pdf> Vendor(s): Digikey: 1649-1008-1-ND <https://www.digikey.com/product-detail/en/sensirion-ag/SHT25/1649-1008-1-ND/5872290>; MANUFACTURER: Sensirion AG; MPN: SHT25; VENDOR: Digikey; VLINK: https://www.digikey.com/product-detail/en/sensirion-ag/SHT25/1649-1008-1-ND/5872290; VPN: 1649-1008-1-ND
U6 = openag-sensors:CCS811: LOW POWER DIGITAL SENSOR FOR IND Description: Air Quality Sensor I²C Technical Specifications: Type: Air Quality Output: I²C Operating Temperature: -5°C ~ 50°C Voltage - Supply: 1.8 V ~ 3.6 V Current - Supply: 26mA Datasheet(s): CCS811 Datasheet <http://ams.com/eng/content/download/951091/2269479/471718> CCS811 Factsheet <http://ams.com/eng/content/view/download/490399> Vendor(s): Digikey: CCS811CT-ND <https://www.digikey.com/product-detail/en/ams/CCS811/CCS811CT-ND/6569300>; MANUFACTURER: ams; MPN: CCS811; VENDOR: Digikey; VLINK: https://www.digikey.com/product-detail/en/ams/CCS811/CCS811CT-ND/6569300; VPN: CCS811CT-ND
U7 = openag-sensors:T6713-5K: CO2 MODULE 5000PPM DIFFUSION Description: CO2 Sensor I²C Technical Specifications: Type: CO2 Accuracy: ±2% Output: I²C Operating Temperature: 14 ~ 140°F (-10 ~ 60°C) Voltage - Supply: 4.5 V ~ 5.5 V Current - Supply: 200mA Datasheet(s): T6713 Series Datasheet <http://www.amphenol-sensors.com/en/component/edocman/297-telaire-t6713-series-datasheet/download?Itemid=591> Telaire CO2 Module Selection Guide <http://www.amphenol-sensors.com/en/component/edocman/488-telaire-co2-module-selection-guide-single-or-dual-channel/download?Itemid=591> T67xx Appl Note <http://www.amphenol-sensors.com/en/component/edocman/332-telaire-6700-series-application-note/download?Itemid=591> Vendor(s): Digikey: 235-1374-ND <https://www.digikey.com/product-detail/en/amphenol-advanced-sensors/T6713-5K/235-1374-ND/5027892>; MANUFACTURER: Amphenol Advanced Sensors; MPN: T6713-5K; VENDOR: Digikey; VLINK: https://www.digikey.com/product-detail/en/amphenol-advanced-sensors/T6713-5K/235-1374-ND/5027892; VPN: 235-1374-ND
U8 = openag-sensors:HPP845E034R5: SENSOR HUMID/TEMP 3V I2C 3% SMD Description: Humidity Temperature Sensor 0 ~ 100% RH I²C ±5% RH 5s Surface Mount Technical Specifications: Sensor Type: Humidity, Temperature Humidity Range: 0 ~ 100% RH Output Type: I²C Output: 12b Accuracy: ±5% RH Response Time: 5s Voltage - Supply: 1.5 V ~ 3.6 V Mounting Type: Surface Mount Operating Temperature: -40°C ~ 125°C Datasheet(s): HTU20D(F) Series (HPP845E034Rx) Datasheet <http://www.te.com/commerce/DocumentDelivery/DDEController?Action=srchrtrv&DocNm=HPC202_5&DocType=Data+Sheet&DocLang=English> Vendor(s): Digikey: 223-1592-1-ND <https://www.digikey.com/product-detail/en/te-connectivity-measurement-specialties/HPP845E034R5/223-1592-1-ND/5416096>; MANUFACTURER: TE Connectivity Measurement Specialties; MPN: HPP845E034R5; VENDOR: Digikey; VLINK: https://www.digikey.com/product-detail/en/te-connectivity-measurement-specialties/HPP845E034R5/223-1592-1-ND/5416096; VPN: 223-1592-1-ND
U9 = openag-regulators:LM2937IMP-3.3/NOPB: IC REG LIN 3.3V 400MA SOT223-4 Description: Linear Voltage Regulator IC Positive Fixed 1 Output 3.3V 400mA SOT-223-4 Technical Specifications: Output Configuration: Positive Output Type: Fixed Number of Regulators: 1 Voltage - Input (Max): 26V Voltage - Output (Min/Fixed): 3.3V Voltage Dropout (Max): 1V @ 50mA Current - Output: 400mA Current - Quiescent (Iq): 2mA Current - Supply (Max): 1.25A Protection Features: Over Temperature, Reverse Polarity, Short Circuit Operating Temperature: -40°C ~ 85°C Mounting Type: Surface Mount Package / Case: TO-261-4, TO-261AA Supplier Device Package: SOT-223-4 Base Part Number: LM2937 Datasheet(s): LM2937-2.5, LM2937-3.3 Datasheet <http://www.ti.com/lit/ds/symlink/lm2937-2.5.pdf> Vendor(s): Digikey: LM2937IMP-3.3/NOPBCT-ND <https://www.digikey.com/product-detail/en/texas-instruments/LM2937IMP-3.3-NOPB/LM2937IMP-3.3-NOPBCT-ND/270742#>; MANUFACTURER: Texas Instruments; MPN: LM2937IMP-3.3/NOPB; VENDOR: Digikey; VLINK: https://www.digikey.com/product-detail/en/texas-instruments/LM2937IMP-3.3-NOPB/LM2937IMP-3.3-NOPBCT-ND/270742#; VPN: LM2937IMP-3.3/NOPBCT-ND
U$1 = openag-frames:AUTHOR; AUTHOR: Jake Rye; MPN: N/A
U$2 = openag-frames:TITLE; MPN: N/A; TITLE: Air Sensor Node; URL: https://github.com/openaginitiative/openag_eagle/proj/sensor-nodes/air; VER: 1.1

## Board
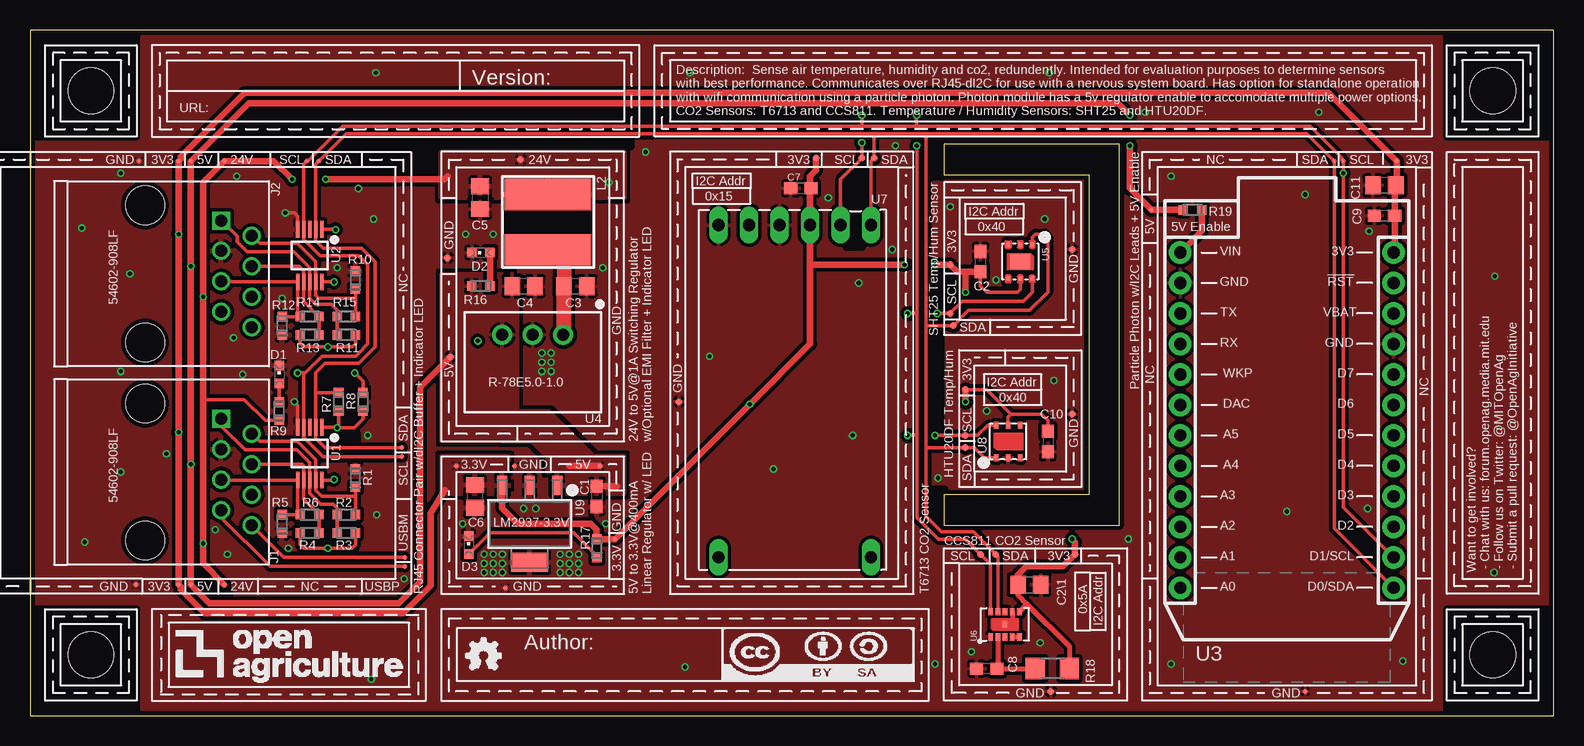
[diagram p2: board, top side]
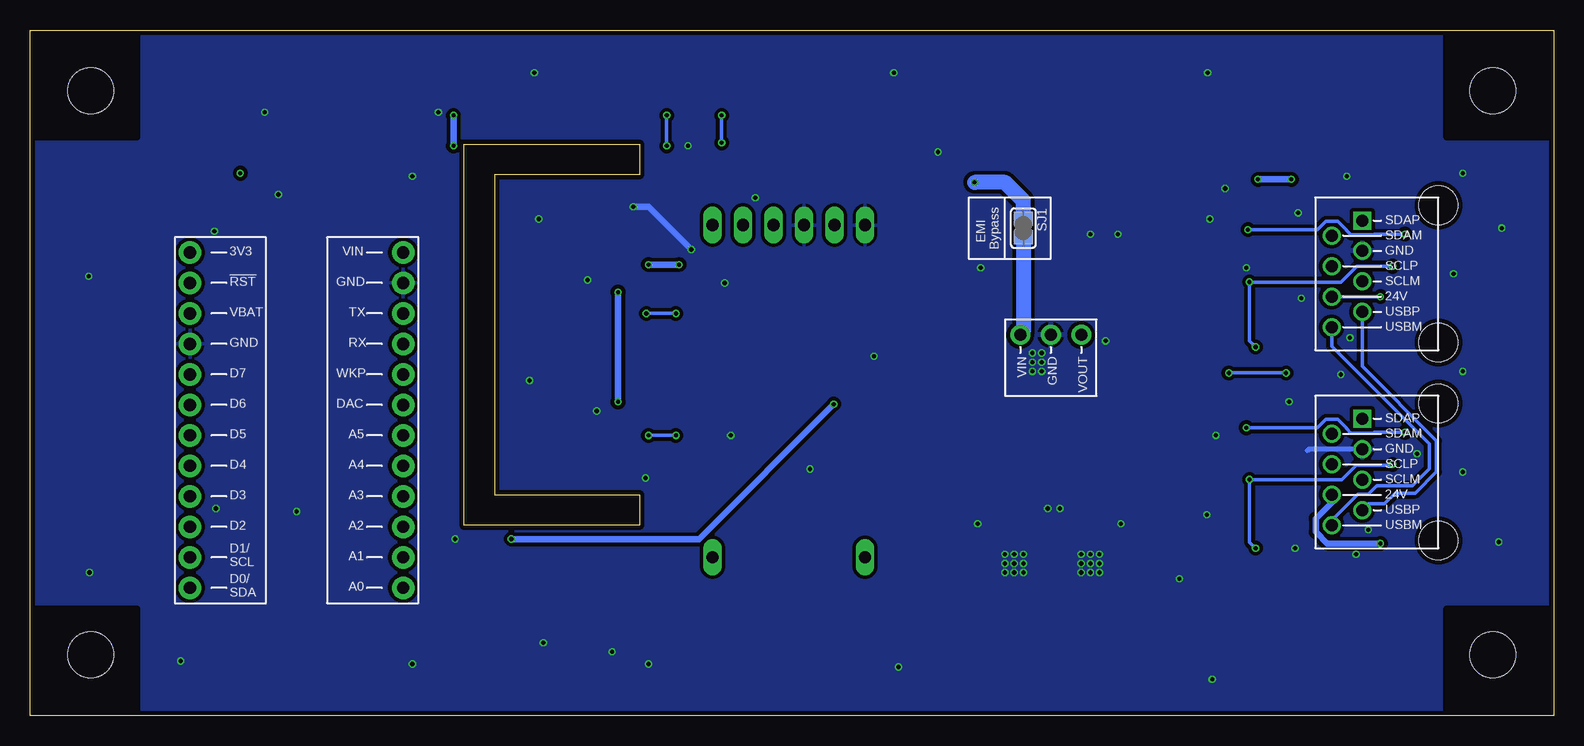
[diagram p3: board, bottom side, seen from below]

Size 127 x 57.15 mm. Coordinates in mm from the lower left corner, seen from the top.
Outline: 76.2,45.09 88.27,45.09 88.27,18.41 76.2,18.41 76.2,15.88 90.81,15.88 90.81,47.62 76.2,47.62 76.2,45.09
Outline: 0,0 127,0 127,57.15 0,57.15 0,0
Copper layers (1*16): Top 0.035559375mm / dielectric 1.6mm / Bottom 0.035559375mm
Design rules "oshpark-2layer-mask": minimum track width 6mil, minimum drill 10mil, track to track 6mil, track to pad 6mil, pad to pad 6mil, via to via 6mil, smd to smd 6mil, copper to edge 15mil, drill to drill 6mil, minimum pad ring 5mil, minimum via ring 5mil, stop-mask expansion 2.5mil, vias tented up to drill 20mil, thermal gap 10mil
tRestrict: 9 lines

### Footprints (pad centres in the part's own frame; a part is rotated, then mirrored left to right if it is on the bottom)
C0603 = smd 1.1 x 1: 1 -0.85,0; 2 0.85,0
C0805 = smd 1.3 x 1.5: 1 -0.95,0; 2 0.95,0
CHIPLED_0603 = smd 0.8 x 0.8: A 0,-0.75; C 0,0.75
RJ45-DI2C-USB-54602-908LF = drill 1: 24V(6) 1.905,8.89; DSCLM(5) 0.635,6.35; DSCLP(4) -0.635,8.89; DSDAM(2) -3.175,8.89; GND(3) -1.905,6.35; USBM(8) 4.445,8.89; USBP(7) 3.175,6.35 | drill 1 square: DSDAP(1) -4.445,6.35 | hole 3.2: -5.715,0; 5.715,0
29333C = smd 2.6 x 7.2: 1 -2.3,0; 2 2.3,0
RC0603N = smd 0.756 x 0.8: 1 -0.778,0; 2 0.778,0
R1206 = smd 1.6 x 1.803: 1 -1.422,0; 2 1.422,0
EMI-BYPASS = smd 1.168 x 1.6: 1 -0.762,0.254; 2 0.762,0.254
TP04R = smd 0.4 x 0.4: 1 0,0
TP06R = smd 0.6 x 0.6: TP 0,0
SOP50P490X110-10N = smd 1.4 x 0.3: 1 -2.2,1; 2 -2.2,0.5; 3 -2.2,0; 4 -2.2,-0.5; 5 -2.2,-1; 6 2.2,-1; 7 2.2,-0.5; 8 2.2,0; 9 2.2,0.5; 10 2.2,1
PHOTON = drill 1.016 pad 1.88: 1 1.27,32.258; 2 1.27,29.718; 3 1.27,27.178; 4 1.27,24.638; 5 1.27,22.098; 6 1.27,19.558; 7 1.27,17.018; 8 1.27,14.478; 9 1.27,11.938; 10 1.27,9.398; 11 1.27,6.858; 12 1.27,4.318; 13 19.05,4.318; 14 19.05,6.858; 15 19.05,9.398; 16 19.05,11.938; 17 19.05,14.478; 18 19.05,17.018; 19 19.05,19.558; 20 19.05,22.098; 21 19.05,24.638; 22 19.05,27.178; 23 19.05,29.718; 24 19.05,32.258
R-78E5.0-1.0 = drill 1 pad 1.676: 1 -2.54,0; 2 0,0; 3 2.54,0
SHT2X = smd 0.3 x 0.4: 1 -1,-1.4; 2 0,-1.4; 3 1,-1.4; 4 1,1.4; 5 0,1.4; 6 -1,1.4 | smd 1.651 x 1.27: 7 0,0
CCS811 = smd 0.6 x 0.4: 1 -1.05,1.2; 2 -1.05,0.6; 3 -1.05,0; 4 -1.05,-0.6; 5 -1.05,-1.2; 6 1.05,-1.2; 7 1.05,-0.6; 8 1.05,0; 9 1.05,0.6; 10 1.05,1.2; EP 0,0
T6713 = drill 1.016 long: 1 1.27,-1.27; 2 1.27,-3.81; 3 1.27,-6.35; 4 1.27,-8.89; 5 1.27,-11.43; 6 1.27,-13.97; 7 28.96,-13.97; 8 28.96,-1.27
HTU20D(F) = smd 0.4 x 0.6: 1 -1,-1.35; 2 0,-1.35; 3 1,-1.35; 4 1,1.35; 5 0,1.35; 6 -1,1.35
MP04A = smd 1.6 x 0.838: 1 -3.2,2.3; 2 -3.2,0; 3 -3.2,-2.3 | smd 1.6 x 3.099: 4 3.2,0
CORNER-150 = hole 3.81: 0,0

### Placement (x,y rotation side)
C1  47.24,18.29 270 top
C2  79.25,37.85 90 top
C2\1  83.31,10.92 0 top
C3  45.47,35.81 0 top
C4  41.15,35.81 0 top
C5  37.53,43.18 270 top
C6  37.08,18.29 270 top
C7  64.26,43.94 180 top
C8  79.76,3.94 180 top
C9  112.9,41.66 180 top
C10  84.84,22.86 270 top
C11  112.9,44.2 180 top
D1  20.78,28.45 0 top
D2  37.59,38.61 90 top
D3  36.58,14.22 0 top
J1  9.6,20.32 270 top
J2  9.6,36.83 270 top
L2  43.18,41.15 270 top
R1  27.13,19.81 90 top
R2  26.37,16.76 0 top
R3  26.37,15.24 180 top
R4  23.32,15.24 180 top
R5  21.03,16 90 top
R6  23.32,16.76 0 top
R7  25.73,26.16 270 top
R8  27.76,26.16 270 top
R9  20.78,25.4 270 top
R10  27.13,36.32 90 top
R11  26.37,31.75 180 top
R12  21.03,32.51 90 top
R13  23.32,31.75 180 top
R14  23.32,33.27 0 top
R15  26.37,33.27 0 top
R16  37.59,35.81 180 top
R17  47.24,13.97 90 top
R18  85.22,3.94 0 top
R19  96.9,42.16 0 top
SJ1  44.45,40.64 270 bottom
TP1  12.4,10.92 0 top
TP2  13.41,10.92 0 top
TP3  8.84,10.92 0 top
TP4  16.21,10.92 0 top
TP5  30.99,22.35 0 top
TP6  30.99,21.59 0 top
TP7  31.24,12.45 0 top
TP8  31.24,13.21 0 top
TP9  12.4,46.23 0 top
TP10  13.41,46.23 0 top
TP11  16.21,46.23 0 top
TP12  9.09,46.23 0 top
TP13  79.25,13.46 270 top
TP14  80.52,13.46 270 top
TP15  85.09,2.03 270 top
TP16  87.12,13.46 270 top
TP17  76.96,32.51 0 top
TP18  76.71,33.53 0 top
TP19  86.87,38.86 0 top
TP20  76.71,37.59 0 top
TP21  77.98,22.35 0 top
TP22  77.98,23.37 0 top
TP23  77.98,27.18 0 top
TP24  86.87,25.15 0 top
TP25  70.36,46.48 270 top
TP26  69.34,46.48 270 top
TP27  65.53,46.48 270 top
TP28  54.1,26.16 270 top
TP29  23.06,46.23 0 top
TP30  24.08,46.23 0 top
TP34  35.05,29.91 180 top
TP35  40.89,46.35 180 top
TP36  34.8,38.16 180 top
TP39  48.77,14.73 180 top
TP40  47.5,20.83 180 top
TP41  39.62,10.67 180 top
TP42  35.56,20.83 180 top
TP43  40.39,20.83 180 top
TP44  109.47,46.23 270 top
TP45  113.92,46.23 270 top
TP46  106.3,2.03 270 top
TP47  108.71,46.23 270 top
TP48  93.47,42.16 90 top
U1  23.32,21.84 270 top
U2  23.32,38.35 270 top
U3  94.61,6.35 0 top
U4  41.91,31.75 180 top
U5  82.55,37.85 180 top
U6  81.28,7.62 90 top
U7  71.37,42.16 270 top
U8  81.53,22.86 0 top
U9  41.66,16 270 top
U$1  34.29,1.27 0 top
U$2  10.16,48.26 0 top
U$5  [LOGO-900X300]  10.16,1.27 0 top
U$6  [CORNER-150]  5.08,5.08 0 top
U$7  [CORNER-150]  121.92,5.08 90 top
U$8  [CORNER-150]  5.08,52.07 270 top
U$9  [CORNER-150]  121.92,52.07 180 top

### Tracks (layer width: path | path; a pad name or v marks a point on that pad's centre or on a via)
24V_EMI
  Top 1.27: U4.1 44.52,31.82 C3.1 44.52,37.51 arc90 L2.2
  Bottom 1.27: SJ1.2 44.2,32 U4.1
+3V3  (via drill 0.35)
  Top 0.305: C10.1 84.84,24.64 84.33,25.15 81.79,25.15 | U8.5 81.53,24.89 81.79,25.15 | C2.1 79.25,35.81 79.76,35.31 82.3,35.31 82.55,35.56 U5.5 | TP23.TP 79.76,27.18 81.79,25.15 | v25.6,24 25.73,24.13 R7.2 | v25.48,40.51 25.43,40.55 U2.1 | v25.6,24 27,24 27.76,24.77 R8.2 | U1.1 25.56,24.04 v25.6,24
  Top 0.356: 82.75,8.94 U6.6
  Top 0.406: 83.12,9.31 82.75,8.94 82.59,8.78 | 83.12,9.31 86.64,5.8 R18.2 | 83.12,9.31 82.36,10.08 C2\1.1
  Top 0.559: C2.1 77.98,37 | 77.98,37 77.3,37 TP20.TP v75.44,37.59 | C2\1.1 82.36,11.75 83.06,12.45 86.11,12.45 TP16.TP 87.12,14.48 v86.87,14.73 | 77.98,37 v77.98,35.31 | v77.98,26.16 TP23.TP | U9.3 39.36,17.29 40.64,16 46.74,16 47.24,15.49 R17.2 47.26,14.73 TP39.1 v60.01,25.97 65.02,30.99 65.02,37.59 | 34.54,18.8 33.38,16.87 33.38,10.82 31.09,8.53 14.58,8.53 12.55,10.56 12.55,10.77 TP1.1 v12.39,23.62 v12.39,40.13 TP9.1 12.55,46.38 12.55,46.59 17.88,51.92 108.23,51.92 TP45.1 113.92,44.26 C11.1 113.75,44.35 C9.1 | 113.85,41.76 C9.1 | C9.1 113.75,38.7 U3.24 | 65.02,43.85 U7.3 65.02,37.59 | 65.02,43.85 C7.1 | TP27.TP 65.53,45.47 65.02,44.96 65.02,43.85 | v72.9,37.59 65.02,37.59
  Bottom 0.305: v25.6,24 19.69,24 18.99,24.7 17.99,24.7 17.28,24 17.28,23.95 16.89,23.56 15.01,23.56 14.95,23.62 v12.39,23.62 | v12.39,40.13 14.95,40.13 15.01,40.07 16.89,40.07 17.28,40.46 17.28,40.51 17.99,41.21 18.99,41.21 19.69,40.51 v25.48,40.51
  Bottom 0.559: v77.98,35.31 v77.98,26.16 | v75.44,37.59 v72.9,37.59 | v86.87,14.73 71.24,14.73 v60.01,25.97
  pour Top (isolate 0.305): 34.29,21.59 34.29,18.54 39.88,18.54 39.88,21.59
+5V  (via drill 0.35)
  Top 0.305: v25.35,36.14 25.34,36.15 U2.10 | R13.2 22.54,31 22.81,30.73 v24.84,30.73 26.87,30.73 27.14,31 R11.1 | v25.35,19.68 25.31,19.64 U1.10 | R4.2 22.54,14.24 22.81,13.97 v24.84,13.97 26.87,13.97 27.14,14.24 R3.1
  Top 0.559: 48.93,19.14 C1.1 | TP40.1 44.96,20.83 | TP34.TP 32.51,27.37 32.51,11.18 30.73,9.4 14.94,9.4 TP2.1 v13.41,20.95 v13.41,37.47 TP10.1 18.24,51.05 90.68,51.05 v91.69,50.04 | R19.1 TP48.1 91.69,43.94 v91.69,47.5
  Bottom 0.305: v24.84,30.73 25.35,31.24 v25.35,36.14 17.71,36.14 16.39,37.47 v13.41,37.47 | v13.41,20.95 13.47,20.89 16.45,20.89 17.66,19.68 v25.35,19.68 25.35,14.48 v24.84,13.97
  Bottom 0.559: v91.69,50.04 v91.69,47.5
  pour Top (isolate 0.305): 34.29,22.86 34.29,36.83 40.64,36.83 40.64,22.86
  pour Top (isolate 0.305): 49.53,21.59 43.69,21.59 43.69,18.54 49.53,18.54
  pour Top (isolate 0.406): 43.18,20.32 43.18,21.59 41.91,22.86 39.37,22.86 39.37,25.4 43.18,25.4 46.99,21.59 46.99,20.32
+24V  (via drill 0.35)
  Top 0.305: 14.55,18.41 14.43,18.29 | 14.43,26.35 17.86,26.35 19.59,24.62 R9.2
  Top 0.559: TP4.1 14.43,12.7 v14.43,14.35 14.43,18.29 14.43,26.35 v14.43,34.92 14.43,44.45 TP11.1 20.32,46.23 v21.84,44.7 | v24.64,44.7 34.54,44.7 34.8,44.96
  Bottom 0.305: J2.24V(6) v14.43,34.92
  Bottom 0.559: v14.43,14.35 18.86,14.35 19.82,15.32 19.82,16.43 18.49,17.76 J1.24V(6) | v21.84,44.7 v24.64,44.7
  Bottom 1.27: SJ1.1 44.2,42.93 45.72,44.45 v48.26,44.45
  pour Top (isolate 0.406): 34.29,43.18 34.29,46.99 49.53,46.99 49.53,43.18
DSCLM_1
  Top 0.305: 22.3,16.76 R6.1 22.44,16.8 22.32,16.92 U1.6 15.99,19.64 J1.DSCLM(5) | 22.3,16.76 21.05,16.76 R5.2 | 22.32,16.78 22.3,16.76
DSCLM_2
  Top 0.305: R12.2 21.05,33.27 R14.1 22.32,33.5 U2.6 15.99,36.15 J2.DSCLM(5)
DSCLP_1
  Top 0.305: R4.1 R6.2 22.82,18.04 U1.7 22.82,20.82 22.68,20.95 J1.DSCLP(4)
DSCLP_2
  Top 0.305: R13.1 R14.2 22.82,34.54 U2.7 22.82,37.08 22.43,37.47 J2.DSCLP(4)
DSDAM_1
  Top 0.305: R2.2 27.14,18.29 | 27.14,18.29 27.14,18.76 R1.1 | 27.14,18.29 24.33,18.29 23.82,18.8 U1.9 23.82,21.33 22.29,22.86 19.13,22.86 J1.DSDAM(2)
DSDAM_2
  Top 0.305: R10.1 27.13,34.8 | 27.13,34.8 24.08,34.8 23.82,35.06 U2.9 23.82,37.84 | 27.13,34.8 27.13,33.29 R15.2 | 23.82,37.84 23.82,37.85 | 23.82,37.84 22.29,39.37 19.13,39.37 J2.DSDAM(2)
DSDAP_1
  Top 0.305: R2.1 R3.2 | 25.52,16.76 R2.1 | R2.1 25.59,17.29 25.25,17.62 24.24,17.62 23.32,18.54 U1.8 23.32,21.08 22.24,22.16 17.92,22.16 15.95,24.13 J1.DSDAP(1)
DSDAP_3
  Top 0.305: R11.2 R15.1 25.59,33.8 25.09,34.29 23.82,34.29 23.32,34.8 U2.8 23.32,37.34 21.98,38.67 18.12,38.67 17.28,39.51 17.28,39.94 J2.DSDAP(1)
GND  (via drill 0.35)
  Top 0.305: U1.5 22.32,25.38 | 22.32,25.38 22.3,25.4 | 22.32,25.38 22.32,25.89 v22.05,26.16 | U2.5 22.32,41.64 22.05,41.91 v21.29,41.91
  Top 0.406: U6.7 81.88,7.71 81.79,7.62 U6.EP
  Bottom 0.406: J1.GND(3) 20.4,22.23 20.52,22.1
  Bottom 0.559: v76.71,42.42 75.44,42.42 v71.88,38.86
  other vias: 78.49,5.33 61.98,20.57 28.45,3.05 56.64,29.97 68.58,23.37 84.58,41.4 85.34,27.94 75.44,4.32 37.34,31.24 38.61,40.13 47.75,37.34 42.67,30.23 42.67,29.46 43.43,29.46 43.43,30.23 42.67,28.7 43.43,28.7 36.32,40.13 7.57,20.32 28.91,16.76 7.57,28.7 8.33,36.83 17.73,28.45 7.57,45.21 25.6,37.34 21.54,13.97 27.38,43.94 28.65,41.4 28.14,23.37 15.44,15.49 16.97,31.5 11.38,21.84 16.46,13.46 21.03,34.8 17.22,44.96 44.2,12.7 44.2,13.46 44.96,12.7 44.96,13.46 45.72,13.46 45.72,12.7 44.2,11.94 45.72,11.94 44.96,11.94 39.37,13.46 38.61,13.46 37.85,13.46 39.37,12.7 39.37,11.94 38.61,12.7 38.61,11.94 37.85,11.94 37.85,12.7 42.16,17.27 36.07,16 41.15,17.27 48.01,16 111.63,40.39 104.78,17.02 51.31,46.99 66.55,43.18 72.14,47.5 80.52,36.32 92.96,50.29 107.44,50.29 111.51,17.27 106.3,43.43 114.43,4.57 95.12,4.32 84.2,6.1 91.57,14.73 75.69,19.81 79.76,25.4 69.09,36.07 31.19,11.43 54.61,4.06 4.57,14.48 4.32,40.64 95.12,44.96 122.11,36.64 122.05,11.94 54.99,53.59 28.83,53.59 84.96,53.59
  pour Top (isolate 0.406): 91.44,13.97 91.44,1.27 76.2,1.27 76.2,13.97
  pour Top (isolate 0.305): 77.47,19.05 87.63,19.05 87.63,30.48 77.47,30.48
  pour Top (isolate 0.305): 76.2,31.75 87.63,31.75 87.63,44.45 76.2,44.45
  pour Top (isolate 0.305): 53.34,46.99 53.34,10.16 73.66,10.16 73.66,46.99
  pour Top (isolate 0.305, rank 3): 0,0 127,0 127,57.15 0,57.15
  pour Bottom (isolate 0.305, rank 3): 0,0 127,0 127,57.15 0,57.15
  pour Top (isolate 0.305, rank 2): 34.29,22.86 34.29,46.99 49.53,46.99 49.53,22.86
  pour Bottom (isolate 0.406, rank 2): 49.53,22.86 49.53,46.99 34.29,46.99 34.29,22.86
  pour Top (isolate 0.305): -3.81,10.16 31.75,10.16 31.75,46.99 -3.81,46.99
  pour Bottom (isolate 0.406): 31.75,10.16 31.75,46.99 -3.81,46.99 -3.81,10.16
  pour Top (isolate 0.406, rank 3): 49.53,10.16 49.53,21.59 34.29,21.59 34.29,10.16
  pour Bottom (isolate 0.406): 49.53,10.16 34.29,10.16 34.29,21.59 49.53,21.59
  pour Top (isolate 0.305): 92.71,46.99 92.71,1.27 116.84,1.27 116.84,46.99
  pour Bottom (isolate 0.305): 92.71,46.99 116.84,46.99 116.84,1.27 92.71,1.27
N$4
  Top 0.559: R16.1 38.37,38.58 D2.A
N$5
  Top 0.305: D3.A 38.37,15.27 45.3,15.27 47.24,13.32 R17.1
N$6
  Top 0.305: R9.1 D1.A
N$8
  Top 0.559: 96.01,38.73 U3.1 97.68,40.4 R19.2
N$20
  Top 0.406: U6.4 U6.5
N$21
  Top 0.406: U6.2 80.68,4.01 C8.1 R18.1
SCL  (via drill 0.35)
  Top 0.305: U5.6 83.55,35.29 82.8,34.54 77.72,34.54 TP18.TP v75.63,33.53 | U7.2 67.56,44.7 TP26.TP v69.34,47.75 | U6.10 80.08,12.63 TP13.TP 77.99,14.72 75.72,14.72 73.92,16.52 73.92,23.37 | U8.6 79.84,24.21 78.99,23.37 TP22.TP v75.44,23.37 | 27.38,30.23 27.13,29.97 24.34,29.97 22.94,28.58 | 22.94,28.58 22.31,28.58 v22.3,28.57 | v27.06,28.57 27.76,27.88 R8.1 | 27.38,30.23 | 27.38,30.23 28.14,30.99 28.14,37.59 27.38,38.35 24.18,38.35 22.82,39.72 U2.4 22.82,45.98 TP29.1 23.15,46.23 26.05,49.12 69.34,49.12 | 22.94,28.58 22.82,28.45 U1.4 22.82,23.21 24.43,21.59 TP6.1 | U3.14 109.47,17.4 v109.47,45.22 TP44.1 109.37,46.33 109.37,46.5 106.75,49.12 73.91,49.12 | 69.34,49.12 73.91,49.12 | v69.34,50.04 69.34,49.12 | v73.92,47.5 73.92,33.53 | 73.92,33.53 73.92,23.37 | v73.91,50.04 73.91,49.12 | v73.15,23.37 73.92,23.37 | v73.15,33.53 73.92,33.53
  Bottom 0.305: v22.3,28.57 v27.06,28.57 | v69.34,47.75 v69.34,50.04 | v73.92,47.5 v73.92,50.03 v73.91,50.04 | v75.44,23.37 v73.15,23.37 | v75.63,33.53 v73.15,33.53
SDA
  Top 0.305: U5.1 83.55,39.86 83.82,40.13 84.58,40.13 84.84,39.88 84.84,35.31 83.31,33.78 78.23,33.78 TP17.TP 74.68,32.51 | U6.9 80.68,13.3 TP14.TP 78.65,15.33 75.97,15.33 74.68,16.63 74.68,22.35 | U7.1 70.1,46.23 TP25.TP 70.36,48.51 | U8.1 79.58,21.51 78.74,22.35 TP21.TP 74.68,22.35 | 23.82,26.92 23.82,28.59 24.59,29.36 27.38,29.36 28.75,30.73 28.75,37.84 27.63,38.96 24.43,38.96 23.82,39.58 U2.2 23.82,45.97 TP30.1 26.36,48.51 70.36,48.51 | R7.1 23.83,26.94 23.82,26.92 | TP5.1 24.59,22.35 23.82,23.12 U1.2 23.82,26.92 | U3.13 108.71,15.62 TP47.1 106.43,48.51 74.68,48.51 | 70.36,48.51 74.68,48.51 | 74.68,48.51 74.68,32.51 | 74.68,32.51 74.68,22.35
  Top 0.406: 83.57,39.26 U5.1
USBM
  Top 0.305: TP8.1 21.16,13.21 J1.USBM(8)
  Bottom 0.305: J2.USBM(8) 18.49,30.79 10.37,22.67 10.37,20.57 11.76,19.17 14.74,19.17 15.44,18.48 16.33,18.48 18.49,16.31 J1.USBM(8)
USBP
  Top 0.305: TP7.1 20.02,12.45 15.95,16.51 J1.USBP(7)
  Bottom 0.305: J1.USBP(7) 15.44,17.66 14.11,17.66 13.2,18.57 11.51,18.57 9.76,20.32 9.76,22.92 15.95,29.11 J2.USBP(7)

### Text on the board
tPlace: Description: Sense air temperature, humidity and co2, redundently. Intended for evaluation purposes to determine sensors / with best performance. Communicates over RJ45-dI2C for use with a nervous system board. Has option for standalone operation / with wifi communication using a particle photon. Photon module has a 5v regulator enable to accomodate multiple power options. / CO2 Sensors: T6713 and CCS811. Temperature / Humidity Sensors: SHT25 and HTU20DF. | SCL | 24V | 3V3 | SCL | SDA | Particle Photon w/I2C Leads + 5V Enable | SDA | GND | 3V3 | 5V | 24V | SDA | NC | SCL | 3V3 | I2C Addr | SHT25 Temp/Hum Sensor | 0x15 | I2C Addr | 5V Enable | 0x40 | 5V | GND | 3V3 | GND | NC | SCL | GND | SDA | HTU20DF Temp/Hum | NC | 5V | 3V3 | NC | EDGE | GND | I2C Addr | 0x40 | SCL | SDA | 24V to 5V@1A Switching Regulator / w/Optional EMI Filter + Indicator LED | GND | SCL | 3.3V | GND | 5V | SDA | GND | USBM | 3.3V | CCS811 CO2 Sensor | SCL | SDA | 3V3 | I2C Addr | Want to get involved? / - Chat with us: forum.openag.media.mit.edu / - Follow us on Twitter: @MITOpenAg / - Submit a pull request: @OpenAgInitiative | GND | 3V3 | GND | 0x5A | 5V | 24V | NC | USBP | RJ45 Connector Pair w/dI2C Buffer + Indicator LED | 5V to 3.3V@400mA / Linear Regulator w/ LED | T6713 CO2 Sensor | GND | GND